# Altium schematic sheet PlaceHolder_PGAs.SchDoc
size A; SheetNumber: 7; SheetTotal: 7
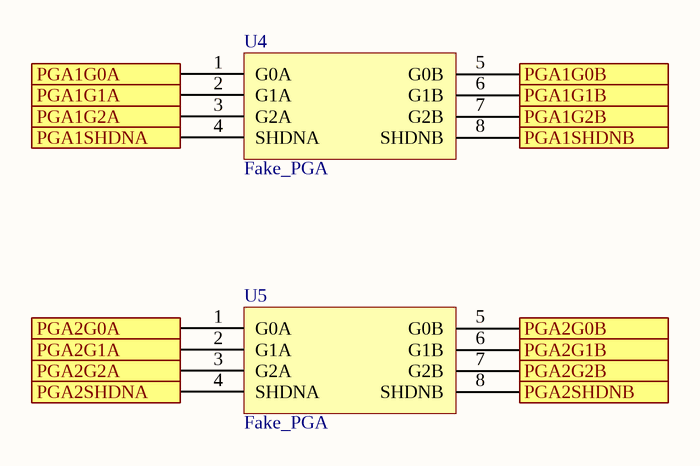
[diagram p0: PlaceHolder_PGAs.SchDoc]

## Parts
U4  Fake_PGA
U5  Fake_PGA

## Ports
PGA1G0A (in), PGA1G0B (in), PGA1G1A (in), PGA1G1B (in), PGA1G2A (in), PGA1G2B (in), PGA1SHDNA (in), PGA1SHDNB (in), PGA2G0A (in), PGA2G0B (in), PGA2G1A (in), PGA2G1B (in), PGA2G2A (in), PGA2G2B (in), PGA2SHDNA (in), PGA2SHDNB (in)

## Nets
PGA1G0A: U4.1(G0A) ; port PGA1G0A
PGA1G0B: U4.5(G0B) ; port PGA1G0B
PGA1G1A: U4.2(G1A) ; port PGA1G1A
PGA1G1B: U4.6(G1B) ; port PGA1G1B
PGA1G2A: U4.3(G2A) ; port PGA1G2A
PGA1G2B: U4.7(G2B) ; port PGA1G2B
PGA1SHDNA: U4.4(SHDNA) ; port PGA1SHDNA
PGA1SHDNB: U4.8(SHDNB) ; port PGA1SHDNB
PGA2G0A: U5.1(G0A) ; port PGA2G0A
PGA2G0B: U5.5(G0B) ; port PGA2G0B
PGA2G1A: U5.2(G1A) ; port PGA2G1A
PGA2G1B: U5.6(G1B) ; port PGA2G1B
PGA2G2A: U5.3(G2A) ; port PGA2G2A
PGA2G2B: U5.7(G2B) ; port PGA2G2B
PGA2SHDNA: U5.4(SHDNA) ; port PGA2SHDNA
PGA2SHDNB: U5.8(SHDNB) ; port PGA2SHDNB